# Altium schematic sheet regulation.SchDoc
size A4
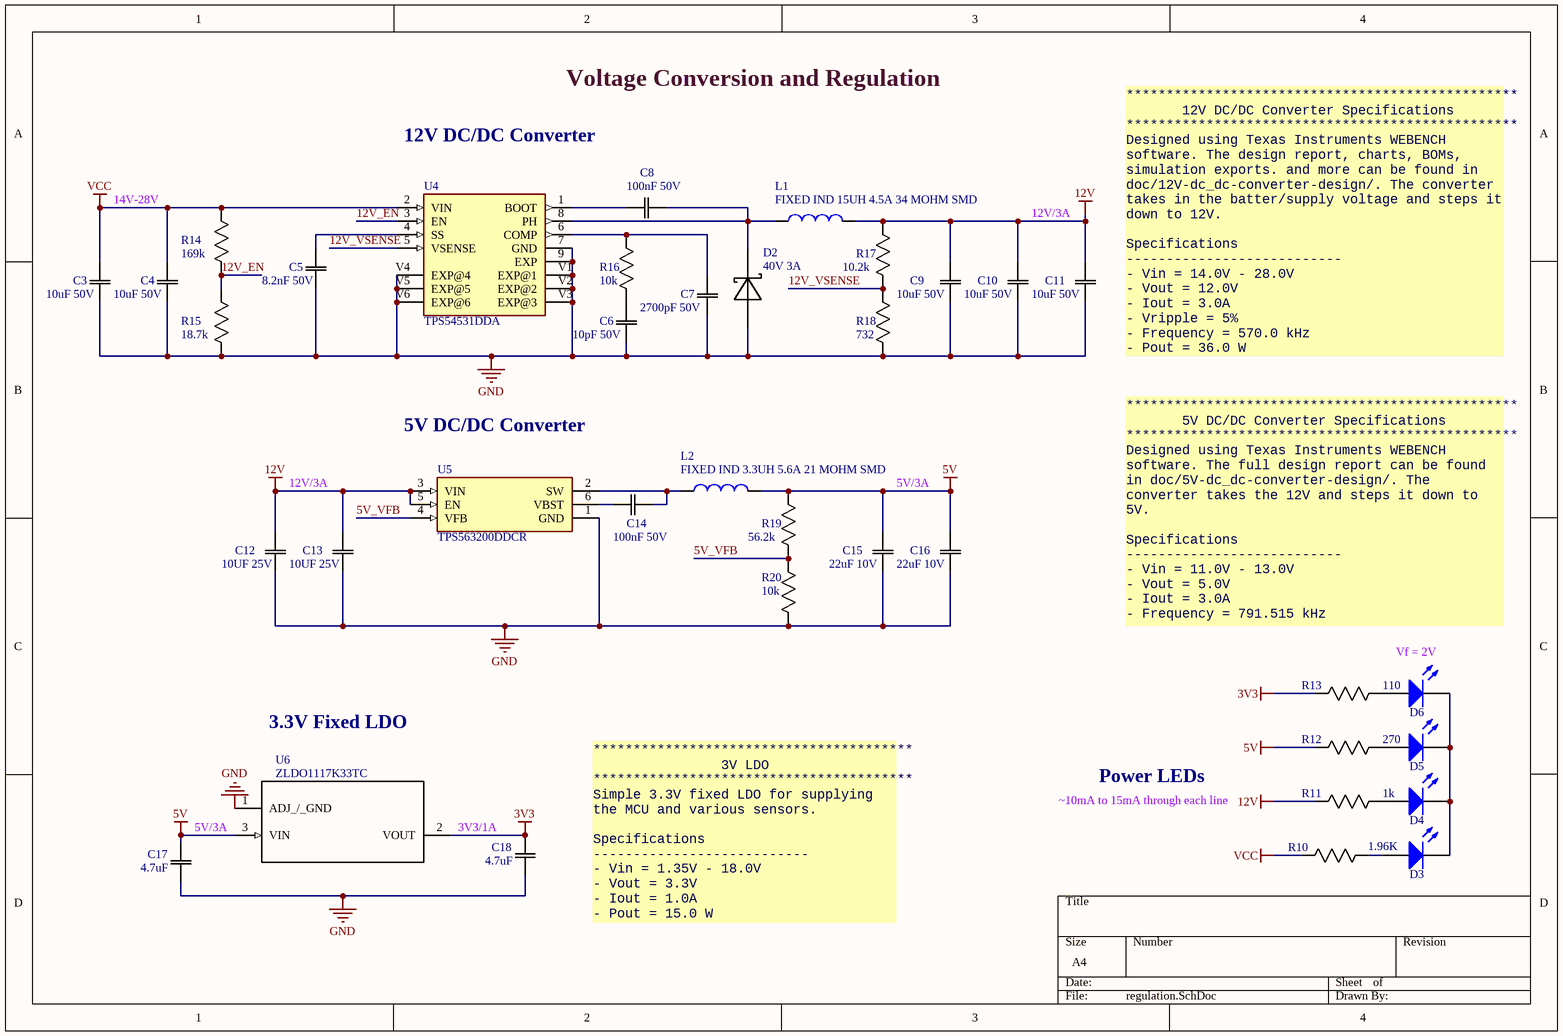
[diagram p0: regulation.SchDoc]

## Parts
C3  10uF 50V  [1210]
C4  10uF 50V  [1210]
C5  8.2nF 50V  [0805]
C6  10pF 50V  [0603]
C7  2700pF 50V  [0805]
C8  100nF 50V  [0805]
C9  10uF 50V  [1210]
C10  10uF 50V  [1210]
C11  10uF 50V  [1210]
C12  10UF 25V  [1206]
C13  10UF 25V  [1206]
C14  100nF 50V  [0805]
C15  22uF 10V  [0805]
C16  22uF 10V  [0805]
C17  4.7uF  [0805]
C18  4.7uF  [0805]
D2  40V 3A  [DO-214AC]
D3  LED2  [3.2X1.6X1.1]  (value not drawn)
D4  LED2  [3.2X1.6X1.1]  (value not drawn)
D5  LED2  [3.2X1.6X1.1]  (value not drawn)
D6  LED2  [3.2X1.6X1.1]  (value not drawn)
L1  FIXED IND 15UH 4.5A 34 MOHM SMD
L2  FIXED IND 3.3UH 5.6A 21 MOHM SMD
R10  1.96K  [0805]
R11  1k  [0805]
R12  270  [0805]
R13  110  [0805]
R14  169k  [0805]
R15  18.7k  [1206]
R16  10k  [0805]
R17  10.2k  [0805]
R18  732  [0805]
R19  56.2k  [0603]
R20  10k  [0805]
U4  TPS54531DDA  [8-PowerSOIC]
U5  TPS563200DDCR  [TSOT-23-6]
U6  ZLDO1117K33TC  [TO-252-3]

## Nets
3V3: C18.2(C2) R13.1(R1) U6.2(VOUT)
5V: C15.2(C2) C16.2(C2) C17.2(C2) L2.2 R12.1(R1) R19.1(R1) U6.3(VIN)
12V: C9.2(C2) C10.2(C2) C11.2(C2) C12.2(C2) C13.2(C2) L1.2 R11.1(R1) R17.2(R2) U5.3(VIN) U5.5(EN)
GND: C3.1(C1) C4.1(C1) C5.1(C1) C6.1(C1) C7.1(C1) C9.1(C1) C10.1(C1) C11.1(C1) C12.1(C1) C13.1(C1) C15.1(C1) C16.1(C1) C17.1(C1) C18.1(C1) D2.A R15.2(R2) R18.1(R1) R20.1(R1) U4.7(GND) U4.9(EXP) U4.V1(EXP@1) U4.V2(EXP@2) U4.V3(EXP@3) U4.V4(EXP@4) U4.V5(EXP@5) U4.V6(EXP@6) U5.1(GND) U6.1(ADJ_/_GND)
VCC: C3.2(C2) C4.2(C2) R10.1(R1) R14.1(R1) U4.2(VIN)
5V_VFB: R19.2(R2) R20.2(R2) U5.4(VFB)
12V_EN: R14.2(R2) R15.1(R1) U4.3(EN)
12V_VSENSE: R17.1(R1) R18.2(R2) U4.5(VSENSE)
NetC5_2: C5.2(C2) U4.4(SS)
NetC6_2: C6.2(C2) R16.2(R2)
NetC7_2: C7.2(C2) R16.1(R1) U4.6(COMP)
NetC8_1: C8.1(C1) U4.1(BOOT)
NetC8_2: C8.2(C2) D2.C(K) L1.1 U4.8(PH)
NetC14_1: C14.1(C1) U5.6(VBST)
NetC14_2: C14.2(C2) L2.1 U5.2(SW)
NetD3_1: D3.1(A) R10.2(R2)
NetD3_2: D3.2(K) D4.2(K) D5.2(K) D6.2(K)
NetD4_1: D4.1(A) R11.2(R2)
NetD5_1: D5.1(A) R12.2(R2)
NetD6_1: D6.1(A) R13.2(R2)

## Notes on the sheet
- Voltage Conversion and Regulation
- 12V DC/DC Converter
- 14V-28V
- 12V/3A
- (near C11) *************************************************
  12V DC/DC Converter Specifications
  *************************************************
  Designed using Texas Instruments WEBENCH software. The design report, charts, BOMs, simulation exports. and more can be found in doc/12V-dc_dc-converter-design/. The converter takes in the batter/supply voltage and steps it down to 12V.
  Specifications
  ---------------------------
  - Vin = 14.0V - 28.0V
  - Vout = 12.0V
  - Iout = 3.0A
  - Vripple = 5%
  - Frequency = 570.0 kHz
  - Pout = 36.0 W
- 5V DC/DC Converter
- 5V/3A
- *************************************************
  5V DC/DC Converter Specifications
  *************************************************
  Designed using Texas Instruments WEBENCH software. The full design report can be found in doc/5V-dc_dc-converter-design/. The converter takes the 12V and steps it down to 5V.
  Specifications
  ---------------------------
  - Vin = 11.0V - 13.0V
  - Vout = 5.0V
  - Iout = 3.0A
  - Frequency = 791.515 kHz
  - Pout = 15.0 W
- Vf = 2V
- 3.3V Fixed LDO
- Power LEDs
- 3V3/1A
- ~10mA to 15mA through each line
- ****************************************
  3V LDO
  ****************************************
  Simple 3.3V fixed LDO for supplying the MCU and various sensors.
  Specifications
  ---------------------------
  - Vin = 1.35V - 18.0V
  - Vout = 3.3V
  - Iout = 1.0A
  - Pout = 15.0 W

## Library data of the parts
C3 C4 C9-C11 = CAP 10uF 50V: CAP CER 10UF 50V X7R; Tolerance: 10%; Package: 1210; Value: 10uF; Rating: 50V; ComponentLink1Description: digikey; ComponentLink1URL: https://www.digikey.ca/en/products/detail/kemet/C1210C106M5RACTU/4918883
C5 = CAP 8.2nF 50V: CAP CER 8200PF 50V X7R 0805; Tolerance: 10%; Package: 0805; Value: 8.2nF; Rating: 50V; Temperature Coefficient: X7R; Operating Temperature: -55°C ~ 125°C
C6 = CAP 10pF 50V: CAP CER 10PF 50V X7R 0603; Tolerance: 10%; Package: 0603; Value: 10pF; Rating: 50V; ComponentLink1Description: digikey; ComponentLink1URL: https://www.digikey.ca/en/products/detail/kemet/C0603C100K5RAC7867/8572397
C7 = CAP 2700pF 50V: CAP CER 2700PF 50V X7R 0805; Tolerance: 10%; Package: 0805; Value: 2700pF; Rating: 50V; Temperature Coefficient: X7R; Operating Temperature: -55°C ~ 125°C
C8 C14 = CAP 100nF 50V: CAP CER 0.1UF 50V X7R 0805; Tolerance: 10%; Package: 0805; Value: 100nF; Rating: 50V
C12 C13 = CAP 10uF 25V: CAP CER 10UF 25V X5R 1206; Tolerance: 10%; Package: 1206; Value: 10uF; Rating: 25V; Temperature Coefficient: X5R; Operating Temperature: -55°C ~ 85°C
C15 C16 = CAP 22uF 10V: CAP CER 2.2UF 10V X5R 0805; Tolerance: 20%; Package: 0805; Value: 22uF; Rating: 10V; Temperature Coefficient: X5R; Operating Temperature: -55°C ~ 85°C
C17 C18 = CAP 4.7uF 0805: CAP CER 4.7UF 25V X5R 0805; MP: CL21B475KOFNNNE; MF: Samsung Electro-Mechanics; Tolerance: 10%; Rating: 16V; Temperature Coefficient: X7R; Package: 0805; Price: 0,49 CAD; Value: 4.7uF; Digikey: 1276-2873-1-ND; Digikey Link: https://www.digikey.ca/product-detail/en/samsung-electro-mechanics/CL21B475KOFNNNE/1276-2873-1-ND/3890959
D2 = DIODE SCHOTTKY 40V 3A: Diode Schottky 40V 3A Surface Mount SMA; Voltage - Forward (Vf) (Max) @ If: 450mV @ 3A; ComponentLink1Description: digikey; ComponentLink1URL: https://www.digikey.ca/product-detail/en/on-semiconductor/MBR0540T1G/MBR0540T1GOSCT-ND/917967; Voltage - DC Reverse (Vr) (Max): 40V; Package: DO-214AC; Current - Average Rectified (Io): 3A
D3-D6 = LED GREEN SMD: Typical RED, GREEN, YELLOW, AMBER GaAs LED; Voltage - Forward (Vf) (Typ): 2V; Lens Transparency: Clear; Current - Test: 20mA; Package: 1206; Color: Green
L1 = SDR1307-150ML: 15µH Unshielded Wirewound Inductor 4.5A 34mOhm Max Nonstandard; MF: Bourns Inc.; Inductance: 15.0uH; Current - Saturation: 7.5A; MP: SDR1307-150ML; Height - Seated (Max): 0.287"" (7.30mm); ComponentLink1Description: digikey; ComponentLink1URL: https://www.digikey.ca/en/products/detail/bourns-inc/SRU1048-8R2Y/2352912; Digikey: SDR1307-150MLCT-ND; Digikey Link: https://www.digikey.ca/en/products/detail/bourns-inc/SDR1307-150ML/2561929; DC Resistance (DCR): 34mOhm; Operating Temperature: -40°C ~ 125°C; Size / Dimension: 0.512"" L x 0.512"" W (13.00mm x 13.00mm)
L2 = SRN8040-3R3Y: 3.3µH Semi-Shielded Wirewound Inductor 5.6A 21mOhm Max Nonstandard; MF: Bourns Inc.; MP: SRN8040-3R3Y; Price: None; Package: Nonstandard; Inductance: 3.3uH; ComponentLink1Description: digikey; ComponentLink1URL: https://www.digikey.ca/en/products/detail/bourns-inc/SRU1048-8R2Y/2352912; Digikey: SRN8040-3R3YCT-ND; Digikey Link: https://www.digikey.ca/en/products/detail/bourns-inc/SRN8040-3R3Y/2756131
R10 = RES 1.96k 1/8W: RES SMD 1.96K OHM 1% 1/8W 0805; Power (Watts): 0.125W; Package: 0805; Value: 1.96k; Tolerance: 1%
R11 = RES 1k 1/8W: RES SMD 1K OHM 5% 1/8W 0805; Power (Watts): 0.125W; Package: 0805; Value: 1k; Tolerance: 5%
R12 = RES 270 1/8W: RES SMD 270 OHM 5% 1/8W 0805; Power (Watts): 0.125W; Package: 0805; Value: 270; Tolerance: 5%
R13 = RES 110 1/8W: RES SMD 110 OHM 1% 1/8W 0805; Power (Watts): 0.125W; Package: 0805; Value: 110; Tolerance: 1%
R14 = RES 169k 1/8W: RES SMD 169K OHM 1% 1/8W 0805; Power (Watts): 0.125W; Package: 0805; Value: 169k; Tolerance: 1%; ComponentLink1Description: digikey; ComponentLink1URL: https://www.digikey.ca/en/products/detail/yageo/RC0805FR-07169KL/727634
R15 = RES 18.7K OHM 1/8W: RES SMD 18.7K OHM 1% 1/8W; Power (Watts): 0.125W; Value: 18.7k; Tolerance: 1%; Package: 0805; Alternative Package: 1206
R16 R20 = RES 10k 1/8W: RES SMD 10K OHM 1% 1/8W 0805; Power (Watts): 0.125W; Package: 0805; Value: 10k; Tolerance: 1%
R17 = RES 10.2k 1/8W: RES SMD 10.2K OHM 1% 1/8W 0805; Power (Watts): 0.125W; Package: 0805; Value: 10.2k; Tolerance: 1%; ComponentLink1Description: digikey; ComponentLink1URL: https://www.digikey.ca/en/products/detail/panasonic-electronic-components/ERJ-6ENF1022V/111476
R18 = RES 732 1/8W: RES SMD 732 OHM 1% 1/8W 0805; Power (Watts): 0.125W; Package: 0805; Value: 732; Tolerance: 1%
R19 = RES 56.2k 1/10W: RES SMD 56.2K OHM 1% 1/10W 0603; Power (Watts): 0.1W; Package: 0603; Value: 56.2k; Tolerance: 1%
U4 = TPS54531DDA: Buck Switching Regulator IC Positive Adjustable 0.8V 1 Output 5A 8-PowerSOIC _0.154, 3.90mm Width_; MF: Texas Instruments; Value: *; Price: None; Package: SO-8 Texas Instruments; SnapEDA_Link: https://www.snapeda.com/parts/TPS54531DDA/Texas%20Instruments/view-part/289535/?ref=snap; Availability: Unavailable; MP: TPS54531DDA
U5 = TPS563200DDCR: Buck Switching Regulator IC Positive Adjustable 0.76V 1 Output 3A SOT-23-6 Thin, TSOT-23-6; MF: Texas Instruments; Package: TSOT-23 Texas Instruments; Value: *; Price: None; MP: TPS563200DDCR; SnapEDA_Link: https://www.snapeda.com/parts/TPS563200DDCR/Texas%20Instruments/view-part/71685/?ref=snap; Availability: Unavailable
U6 = ZLDO1117K33TC: Linear Voltage Regulator IC Positive Fixed 1 Output  1A TO-252-3; MF: Diodes Incorporated; Package: TO-252-3; MP: ZLDO1117K33TC; Digikey: ZLDO1117K33DIDKR-ND; Digikey Link: https://www.digikey.ca/product-detail/en/diodes-incorporated/ZLDO1117K33TC/ZLDO1117K33DIDKR-ND/2095639